# Altium schematic sheet ESP32S3.SchDoc
size A4; SheetNumber: 3; SheetTotal: 7
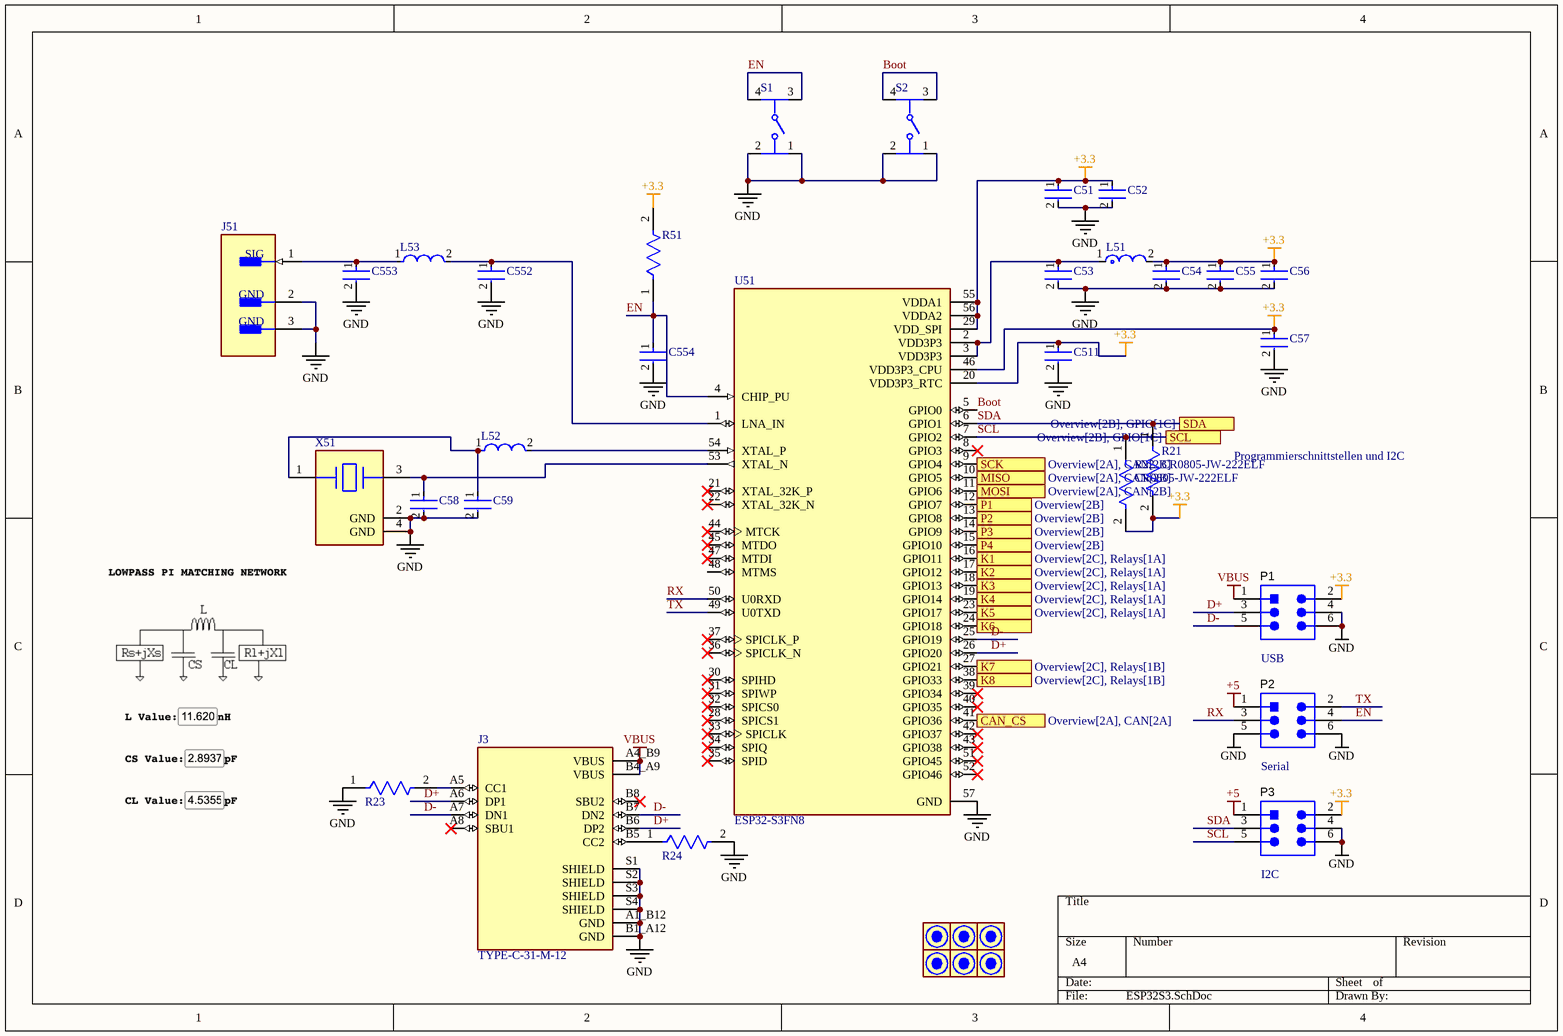
[diagram p0: ESP32S3.SchDoc]

## Parts
(Parts that share a designator on the sheet are numbered #1, #2 ... from top to bottom, then left to right.)
C51  GRM155R61A105KE15D  [FP-GRM15-0_1-MFG]  (value not drawn)
C52  C0603C103K8RACTU  [FP-C0603C-CF-MFG]  (value not drawn)
C53  CC0402KRX7R6BB104  [FP-CC0402-MFG]  (value not drawn)
C54  C0402C104K8PACTU  [FP-C0402-BB-MFG]  (value not drawn)
C55  GRM155R61A105KE15D  [FP-GRM15-0_1-MFG]  (value not drawn)
C56  CL05A106MP5NUNC  [FP-CL05A106MP5NUNC-MFG]  (value not drawn)
C57  C0402C104K8PACTU  [FP-C0402-BB-MFG]  (value not drawn)
C58  C0603C160J5GACTU  [FP-C0603C-CF-MFG]  (value not drawn)
C59  C0603C160J5GACTU  [FP-C0603C-CF-MFG]  (value not drawn)
C511  CC0402KRX7R6BB104  [FP-CC0402-MFG]  (value not drawn)
C552  GJM1555C1H2R8WB01D  [FP-GJM155-0_05-IPC_C]  (value not drawn)
C553  GJM1555C1H4R5BB01D  [FP-GJM155-0_05-IPC_C]  (value not drawn)
C554  C0402C123K4RACTU  [FP-C0402-BB-MFG]  (value not drawn)
J3  TYPE-C-31-M-12  [HRO_TYPE-C-31-M-12]
J51  U.FL-R-SMT-1(10)  [FP-U_FL-R-SMT-1_10-MFG]  (value not drawn)
L51  LQP03TN2N0B02D  [FP-LQP03TG_02-IPC_A]  (value not drawn)
L52  LQW15AN20NG00D  [FP-LQW15AN_00-W0_6-0_1-MFG]  (value not drawn)
L53  LQW15AN11NG00D  [FP-LQW15AN_00-W0_6-0_1-MFG]  (value not drawn)
M*#1  Passermarke  [Passermarke-Footprint-1]  (value not drawn)
M*#2  Passermarke  [Passermarke-Footprint-1]  (value not drawn)
M*#3  Passermarke  [Passermarke-Footprint-1]  (value not drawn)
M*#4  Passermarke  [Passermarke-Footprint-1]  (value not drawn)
M*#5  Passermarke  [Passermarke-Footprint-1]  (value not drawn)
M*#6  Passermarke  [Passermarke-Footprint-1]  (value not drawn)
P1  5-146130-2  [TECO-5-146130-2_V]  (value not drawn)
P2  5-146130-2  [TECO-5-146130-2_V]  (value not drawn)
P3  5-146130-2  [TECO-5-146130-2_V]  (value not drawn)
R21  CR0805-JW-222ELF  [FP-CR0805-IPC_B]
R22  CR0805-JW-222ELF  [FP-CR0805-IPC_B]
R23  CRCW06035K10FKEA  [FP-CRCW0603-e3-IPC_C]  (value not drawn)
R24  CRCW06035K10FKEA  [FP-CRCW0603-e3-IPC_C]  (value not drawn)
R51  CRCW04021K00FKED  [FP-CRCW0402-e3-MFG]  (value not drawn)
S1  (no value)  [FP-PTS645SM43SMTR92LFS-MFG]
S2  (no value)  [FP-PTS645SM43SMTR92LFS-MFG]
U51  ESP32-S3FN8  [QFN40P700X700X90-57N]
X51  X252040MMB4SI  [FP-ABM10-MFG]  (value not drawn)

## Ports
CAN_CS (see Overview[2A], CAN[2A]), K1 (see Overview[2C], Relays[1A]), K2 (see Overview[2C], Relays[1A]), K3 (see Overview[2C], Relays[1A]), K4 (see Overview[2C], Relays[1A]), K5 (see Overview[2C], Relays[1A]), K6 (see Overview[2C], Relays[1B]), K7 (see Overview[2C], Relays[1B]), K8 (see Overview[2C], Relays[1B]), MISO (see Overview[2A], CAN[2B]), MOSI (see Overview[2A], CAN[2B]), P1 (see Overview[2B]), P2 (see Overview[2B]), P3 (see Overview[2B]), P4 (see Overview[2B]), SCK (out, see Overview[2A], CAN[2B]), SCL (see Overview[2B], GPIO[1C]), SDA (see Overview[2B], GPIO[1C])

## Nets
+3.3: C51.1 C52.1 C54.1 C55.1 C56.1 C57.1 C511.1 L51.2 P1.2 P3.2 R21.2 R22.2 R51.2 U51.20(VDD3P3_RTC) U51.29(VDD_SPI) U51.46(VDD3P3_CPU) U51.55(VDDA1) U51.56(VDDA2)
+5: P2.1 P3.1
GND: C51.2 C52.2 C53.2 C54.2 C55.2 C56.2 C57.2 C58.2 C59.2 C511.2 C552.2 C553.2 C554.2 J3.A1_B12(GND) J3.B1_A12(GND) J3.S1(SHIELD) J3.S2(SHIELD) J3.S3(SHIELD) J3.S4(SHIELD) J51.2(GND) J51.3(GND) P1.4 P1.6 P2.5 P2.6 P3.4 P3.6 R23.1 R24.2 S1.1 S1.2 S2.1 S2.2 U51.57(GND) X51.2(GND) X51.4(GND)
VBUS: J3.A4_B9(VBUS) J3.B4_A9(VBUS) P1.1
Boot: S2.3 S2.4 U51.5(GPIO0)
CAN_CS: U51.41(GPIO36) ; port CAN_CS
D+: J3.A6(DP1) J3.B6(DP2) P1.3 U51.26(GPIO20)
D-: J3.A7(DN1) J3.B7(DN2) P1.5 U51.25(GPIO19)
EN: C554.1 P2.4 R51.1 S1.3 S1.4 U51.4(CHIP_PU)
K1: U51.16(GPIO11) ; port K1
K2: U51.17(GPIO12) ; port K2
K3: U51.18(GPIO13) ; port K3
K4: U51.19(GPIO14) ; port K4
K5: U51.23(GPIO17) ; port K5
K6: U51.24(GPIO18) ; port K6
K7: U51.27(GPIO21) ; port K7
K8: U51.38(GPIO33) ; port K8
MISO: U51.10(GPIO5) ; port MISO
MOSI: U51.11(GPIO6) ; port MOSI
P1: U51.12(GPIO7) ; port P1
P2: U51.13(GPIO8) ; port P2
P3: U51.14(GPIO9) ; port P3
P4: U51.15(GPIO10) ; port P4
RX: P2.3 U51.50(U0RXD)
SCK: U51.9(GPIO4) ; port SCK
SCL: P3.5 R22.1 U51.7(GPIO2) ; port SCL
SDA: P3.3 R21.1 U51.6(GPIO1) ; port SDA
TX: P2.2 U51.49(U0TXD)
NetC53_1: C53.1 L51.1 U51.2(VDD3P3) U51.3(VDD3P3)
NetC58_1: C58.1 U51.53(XTAL_N) X51.3
NetC59_1: C59.1 L52.1 X51.1
NetC552_1: C552.1 L53.2 U51.1(LNA_IN)
NetC553_1: C553.1 J51.1(SIG) L53.1
NetJ3_A5: J3.A5(CC1) R23.2
NetJ3_B5: J3.B5(CC2) R24.1
NetL52_2: L52.2 U51.54(XTAL_P)

Not connected (* = marked no-connect by the designer): J3 A8(SBU1)* B8(SBU2)*; U51 8(GPIO3)* 21(XTAL_32K_P)* 22(XTAL_32K_N)* 28(SPICS1)* 30(SPIHD)* 31(SPIWP)* 32(SPICS0)* 33(SPICLK)* 34(SPIQ)* 35(SPID)* 36(SPICLK_N)* 37(SPICLK_P)* 39(GPIO34)* 40(GPIO35)* 42(GPIO37)* 43(GPIO38)* 44(MTCK)* 45(MTDO)* 47(MTDI)* 48(MTMS) 51(GPIO45)* 52(GPIO46)*

## Notes on the sheet
- Programmierschnittstellen und I2C
- USB
- Serial
- (near P3) I2C

## Library data of the parts
C51 C55 = CMP-2008-04556-2: CAP CER 1UF 10V X5R 0402; Manufacturer: Murata; Material: Ceramic; Tolerance: 10%; Temperature Coefficient: 15%; Octopart: https://octopart.com/grm155r61a105ke15d-murata-197442; Manufacturer Part Number: GRM155R61A105KE15D; Lead Free: Yes; ComponentLink2Description: Datasheet; Temperature: -55°C to +85°C; Temperature Range High: +85°C; Height: 0.55mm; Capacitance: 1uF; Ipc Land Pattern Name: CAPC10050X50; ComponentLink2URL: https://search.murata.co.jp/Ceramy/image/img/A01X/G101/ENG/GRM155R61A105KE15-01A.pdf; Temperature Range Low: -55°C; Device Class L2: Capacitors; Voltage Rating: 10V; RoHS: TRUE; Device Class L1: Passive Components; Device Class L3: Ceramic Capacitors; Temperature Characteristic: X5R; Mouser Description: 0402 1 uF 10 V ±10% Tolerance X5R Surface Mount Multilayer Ceramic Capacitor; Automotive: No; Package: GRM15-0.1; Digikey Description: CAP CER 1UF 10V X5R 0402; Value: 1uF; Category: Cap
C52 = CMP-2006-03048-2: CAP CER 10000PF 10V X7R 0603; Manufacturer: KEMET; Material: Ceramic; Automotive Grade: Grade 1; Value: 10,000 pF; Tolerance: 0.1; Temperature Coefficient: 30ppm/°C; ComponentLink2Description: Datasheet; Automotive: Yes; Mouser Description: Multilayer Ceramic Capacitors MLCC - SMD/SMT 10volts 10000pF X7R 10%; Device Class L3: Ceramic Capacitors; Octopart: https://octopart.com/c0603c103k8ractu-kemet-8375724; Digikey Description: CAP CER 10000PF 10V X7R 0603; Temperature: -55°C to +125°C; Temperature Characteristic: X7R; Device Class L1: Passive Components; Capacitance: 10,000 pF; Lead Free: Yes; Voltage Rating: 10 V; Category: Cap; Height: 0.87mm; Package: C0603C-CF; RoHS: TRUE; Temperature Range High: +125°C; Device Class L2: Capacitors; ComponentLink2URL: https://api.kemet.com/component-edge/download/datasheet/C0603C100J5GACAUTO.pdf; Temperature Range Low: -55°C; Manufacturer Part Number: C0603C103K8RACTU
C53 C511 = CMP-03422-000748-1: CAP CER 0.1UF 10V X7R 0402; Manufacturer: YAGEO; Tolerance: 0.1; Value: 100 nF; Temperature Coefficient: 30ppm/°C; Material: Ceramic; Automotive Grade: NA; Ipc Land Pattern Name: CAPC10050X50; Temperature Range Low: -55°C; Temperature: -55°C to +125°C; Footprint Url: http://www.yageo.com/exep/pages/download/literatures/UPY-C_GEN_24.pdf; Device Class L2: Capacitors; ComponentLink2Description: Datasheet; Temperature Characteristic: X7R; Height: 0.55mm; Mouser Description: Multilayer Ceramic Capacitors MLCC - SMD/SMT 100nF 10V X7R 10%; Temperature Range High: +125°C; Package: CC0402; Digikey Description: CAP CER 0.1UF 10V X7R 0402; Automotive: No; Manufacturer Part Number: CC0402KRX7R6BB104; Voltage Rating: 10 V; Octopart: https://octopart.com/cc0402krx7r6bb104-yageo-8376509; Capacitance: 100 nF; ComponentLink2URL: http://www.yageo.com/documents/recent/UPY-GP_NP0_16V-to-50V_16.pdf; Category: Cap; Lead Free: Yes; Device Class L3: Ceramic Capacitors; RoHS: TRUE; Device Class L1: Passive Components
C54 C57 = CMP-2008-02046-2: CAP CER 0.1UF 10V X5R 0402; Manufacturer: Kemet; Material: Ceramic; Capacitance: 0.10 μF; Temperature Coefficient: 15%; Tolerance: 0.1; Value: 0.10 μF; Package: C0402-BB; Temperature: -55°C to +125°C; ComponentLink2Description: Datasheet; Temperature Characteristic: X5R; Device Class L1: Passive Components; Height: 0.55mm; Lead Free: Yes; ComponentLink2URL: https://content.kemet.com/datasheets/KEM_C1002_X7R_SMD.pdf; Device Class L2: Capacitors; Temperature Range Low: -55°C; Temperature Range High: +125°C; RoHS: TRUE; Octopart: https://octopart.com/c0402c104k8pactu-kemet-140039; Automotive: No; Mouser Description: Capacitor 100 nF 10 VDC 0402; Category: Cap; Voltage Rating: 10 V; Digikey Description: CAP CER 0.1UF 10V X5R 0402; Ipc Land Pattern Name: CAPC10050X50; Device Class L3: Ceramic Capacitors; Manufacturer Part Number: C0402C104K8PACTU
C56 = CMP-13271-000002-1: CAP CER 10UF 10V X5R 0402; Manufacturer: Samsung; Temperature Coefficient: 15%; Tolerance: 20%; Material: Ceramic; Octopart: https://octopart.com/cl05a106mp5nunc-samsung-22457395; Voltage Rating: 10V; RoHS: TRUE; Value: 10uF; Height: 0.7mm; Digikey Description: CAP CER 10UF 10V X5R 0402; Automotive: No; Package: CL05A106MP5NUNC; Device Class L1: Passive Components; Capacitance: 10uF; Temperature Range High: +85°C; ComponentLink2Description: Datasheet; Device Class L2: Capacitors; Temperature Characteristic: X5R; Manufacturer Part Number: CL05A106MP5NUNC; Temperature: -55°C to +85°C; ComponentLink2URL: http://www.samsungsem.com/kr/support/product-search/mlcc/__icsFiles/afieldfile/2019/05/10/19-CL05A106MP5NUNC.pdf; Device Class L3: Ceramic Capacitors; Category: Cap; Temperature Range Low: -55°C; Ipc Land Pattern Name: CAPC10050X50; Lead Free: Yes
C58 C59 = CMP-1035-00716-3: CAP CER 16PF 50V 5% NP0 0603; Manufacturer: KEMET; Automotive Grade: Grade 1; Material: Ceramic; Temperature Coefficient: 30ppm/°C; Tolerance: 0.05; Temperature Characteristic: C0G; Manufacturer Part Number: C0603C160J5GACTU; Octopart: https://octopart.com/c0603c160j5gactu-kemet-9143816; ComponentLink2URL: https://api.kemet.com/component-edge/download/datasheet/C0603C100J5GACAUTO.pdf; Category: Cap; Mouser Description: Multilayer Ceramic Capacitors MLCC - SMD/SMT 50volts 16pF C0G 5%; Device Class L1: Passive Components; Capacitance: 16 pF; Voltage Rating: 50 V; Temperature Range Low: -55°C; Automotive: Yes; Device Class L3: Ceramic Capacitors; Package: C0603C-CF; Temperature Range High: +125°C; Digikey Description: CAP CER 16PF 50V 5% NP0 0603; Value: 16 pF; Lead Free: Yes; Height: 0.87mm; Device Class L2: Capacitors; Temperature: -55°C to +125°C; ComponentLink2Description: Datasheet; RoHS: TRUE
C552 = CMP-2008-03767-2: Multi-Layer Ceramic Capacitor 2.8pF C0G  ±0.05pF 0402 Paper T/R; Voltage Rating (DC): 50V; Case Code (Metric): 1005; Max Operating Temperature: 125°C; Case Code (Imperial): 0402; Width: 0.02inch; Package Quantity: 10000; Case/Package: 0402; Depth: 0.5mm; Radiation Hardening: No; Mount: Surface Mount; Min Operating Temperature: -55°C; Termination: SMD/SMT; Capacitance: 2.8pF; Dielectric: C0G; Thickness: 0.022inch; Length: 1mm; Voltage Rating: 50V; Height: 0.5mm; Packaging: Tape and Reel
C553 = CMP-2008-03776-2: Multi-Layer Ceramic Capacitor 4.5pF C0G  ±0.1pF 0402 Paper T/R; Voltage Rating (DC): 50V; Case Code (Metric): 1005; Length: 1mm; Dielectric: C0G; Package Quantity: 1; Radiation Hardening: No; Case/Package: 0402; Termination: SMD/SMT; Min Operating Temperature: -55°C; Packaging: Tape and Reel; Voltage Rating: 50V; Capacitance: 4.5pF; Case Code (Imperial): 0402; Thickness: 0.022inch; Depth: 0.5mm; Max Operating Temperature: 125°C; Height: 0.5mm; Mount: Surface Mount; Width: 0.02inch
C554 = CMP-1034-01896-3: CAP CER 0.012UF 16V X7R 0402; Manufacturer: Kemet; Tolerance: 0.1; Capacitance: 12,000 pF; Temperature Coefficient: 15%; Value: 12,000 pF; Material: Ceramic; Automotive: No; Temperature Characteristic: X7R; Device Class L1: Passive Components; Height: 0.55mm; Manufacturer Part Number: C0402C123K4RACTU; Device Class L2: Capacitors; Package: C0402-BB; Temperature Range Low: -55°C; Ipc Land Pattern Name: CAPC10050X50; Temperature: -55°C to +125°C; Octopart: https://octopart.com/c0402c123k4ractu-kemet-136706; Lead Free: Yes; Temperature Range High: +125°C; Voltage Rating: 16 V; RoHS: TRUE; Mouser Description: Multilayer Ceramic Capacitors MLCC - SMD/SMT 16volts 12000pF X7R 10%; Category: Cap; ComponentLink2Description: Datasheet; ComponentLink2URL: https://content.kemet.com/datasheets/KEM_C1002_X7R_SMD.pdf; Device Class L3: Ceramic Capacitors; Digikey Description: CAP CER 0.012UF 16V X7R 0402
J3 = CMP-023-000000-1: USB Connectors 24 Receptacle 1 8.94*7.3mm RoHS; MF: HRO Electronics Co., Ltd.; Source: TYPE-C-31-M-12.SchLib; Pin Count: 16; Availability: Not in stock; Package: Package; Price: None; Check_prices: https://www.snapeda.com/parts/TYPE-C-31-M-12/HRO+Electronics+Co.%252C+Ltd./view-part/?ref=eda; MP: TYPE-C-31-M-12; Component Type: Standard; Value: *; SnapEDA_Link: https://www.snapeda.com/parts/TYPE-C-31-M-12/HRO+Electronics+Co.%252C+Ltd./view-part/?ref=snap; Design Item ID: TYPE-C-31-M-12
J51 = CMP-2000-05152-3: CONN U.FL RCPT STR 50 OHM SMD; Max Frequency: 6GHz; Connector Type: Coaxial; Body Plating: Silver; Body Material: Bronze; Impedance: 50R; Dielectric Material: Polymer; Insulation Resistance: 500MR; Gender: Male; Packaging: Cut Tape; Length: 3mm; Package Quantity: 2500; Termination: Solder; Lead Free: Lead Free; Series: U.FL; Min Operating Temperature: -40°C; Fastening Type: Snap; Contact Material: Brass; Orientation: Straight; Wire/Cable Type: Coaxial; Frequency: 6GHz; Contact Plating: Gold; Depth: 3.1mm; Weight: 0.001764oz; Max Operating Temperature: 90°C; Radiation Hardening: No; REACH SVHC: No SVHC; Mount: Surface Mount; Housing Color: Beige
L51 = CMP-06042-013297-1: Film type RF Inductor 2nH ±0.1nH 600mA 0.15Ω 0201 (0603); Current: 400mA; DC Resistance (DCR): 150mR; Core Material: Non-Magnetic; Q Factor: 14; Shielding: Unshielded; Self Resonant Frequency: 12.5GHz; Test Frequency: 500MHz; Height - Seated (Max): 0.013inch; Case/Package: 0201; Depth: 0.33mm; Width: 0.012inch; Mount: Surface Mount; Case Code (Imperial): 0201; Packaging: Tape and Reel; Max DC Current: 600mA; Resistor Type: Thin Film; Case Code (Metric): 0603; Length: 0.6mm; Termination: SMD/SMT; Max Operating Temperature: 125°C; Inductance: 2nH; REACH SVHC: No SVHC; DC Current: 600mA; Package Quantity: 15000; Height: 0.3mm; Military Standard: Not; Min Operating Temperature: -55°C; Current Rating: 600mA
L52 = CMP-06042-008146-1: Wire Wound RF Inductor 20nH ±2% 370mA 0.27Ω 0402 (1005); Q Factor: 25; Current: 850mA; DC Resistance (DCR): 270mR; Core Material: Air; Shielding: Unshielded; Test Frequency: 100MHz; Self Resonant Frequency: 4GHz; Mount: Surface Mount; Lead Free: Lead Free; Package Quantity: 10000; Case Code (Metric): 1005; Case/Package: 0402; DC Current: 370mA; Max DC Current: 370mA; Weight: 2.8E-05oz; Width: 0.02inch; Termination: SMD/SMT; Packaging: Tape and Reel; REACH SVHC: No SVHC; Height: 0.5mm; Case Code (Imperial): 0402; Depth: 0.7mm; Military Standard: Not; Radiation Hardening: No; Inductance Tolerance: 2%; Length: 1mm; Max Operating Temperature: 125°C; Min Operating Temperature: -55°C; Inductance: 20nH; Current Rating: 370mA; Tolerance: 2%
L53 = CMP-06042-008305-1: Wire Wound RF Inductor 11nH ±2% 500mA 0.14Ω 0402 (1005); Core Material: Non-Magnetic; Q Factor: 30; DC Resistance (DCR): 140mR; Shielding: Unshielded; Current: 370mA; Self Resonant Frequency: 5.5GHz; Test Frequency: 100MHz; Max DC Current: 500mA; Weight: 2.8E-05oz; Radiation Hardening: No; Mount: Surface Mount; Width: 0.02inch; Current Rating: 500mA; DC Current: 500mA; Packaging: Tape and Reel; Height: 0.5mm; Length: 1mm; Resistor Type: Wirewound; Inductance: 11nH; Height - Seated (Max): 0.024inch; Case Code (Metric): 1005; Max Operating Temperature: 125°C; Case/Package: 0402; Package Quantity: 10000; Tolerance: 2%; Termination: SMD/SMT; Military Standard: Not; Depth: 0.7mm; Min Operating Temperature: -55°C; Lead Free: Lead Free; Case Code (Imperial): 0402
M*#1-M*#6 = CMP-00001-2
P1-P3 = CMP-1684-00011-1: Male Header, Pitch 2.54 mm, 2 x 3 Position, Height 8.13 mm, -65 to 125 degC, RoHS, Tube; Max Supply Voltage: 5.5 V; Min Supply Voltage: 4.5 V; Nominal Supply Voltage: 5 V; Min Operating Temperature: -40 degC; ComponentLink1URL: http://www.te.com/; ComponentLink2Description: Datasheet; Pins: 3; Max Operating Temperature: 150 degC; PackageDescription: Male Header, Pitch 2.54 mm, 2 x 3 Position, Height 8.13 mm; Package Quantity: 3000; PackageReference: 5-146130-2; DatasheetVersion: Oct-15; ComponentLink1Description: Manufacturer URL; Radiation Hardening: No; Mount: Surface Mount; RoHSCompliant: true; Packaging: Tape and Reel; ComponentLink2URL: http://www.te.com/commerce/DocumentDelivery/DDEController?Action=showdoc&DocId=Customer+Drawing%7F146130%7FM%7Fpdf%7FEnglish%7FENG_CD_146130_M.pdf%7F5-146130-2
R21 R22 = CMP-07231-003724-1: Thick Film Chip Resistors 0805 2.2kΩ 0.125W 5% 200ppm/°C; Voltage Rating: 150V; Max Power Dissipation: 125mW; Resistance: 2.2kR; Packaging: Tape and Reel; REACH SVHC: No SVHC; Case Code (Metric): 2012; Thickness: 508um; Depth: 1.25mm; Radiation Hardening: No; Features: Moisture Resistant; Number of Terminations: 2; Max Operating Temperature: 155°C; Length: 2mm; Width: 1.25mm; Termination: SMD/SMT; Case/Package: 0805; Composition: Thick Film; Package Quantity: 1; Height: 0.024inch; Min Operating Temperature: -55°C; Voltage Rating (DC): 150V; Power Rating: 125mW; Mount: Surface Mount; Contact Plating: Tin; Tolerance: 5%; Military Standard: Not; Case Code (Imperial): 0805; Temperature Coefficient: 200ppm/°C
R23 R24 = CMP-1012-00590-3: RES Thick Film, 5.1kΩ, 1%, 0.1W, 100ppm/°C, 0603; Power Rating: 100mW; Voltage Rating (DC): 75V; Resistance: 5.1kR; Width: 0.85mm; Depth: 0.85mm; Military Standard: Not; Package Quantity: 5000; Case Code (Metric): 1608; Length: 1.55mm; Weight: 7.1E-05oz; Packaging: Tape and Reel; Temperature Coefficient: 100ppm/°C; Case Code (Imperial): 0603; Lead Free: Lead Free; Radiation Hardening: No; Contact Plating: Tin; Composition: Thick Film; Max Operating Temperature: 155°C; Termination: SMD/SMT; Case/Package: 0603; Min Operating Temperature: -55°C; Tolerance: 1%; Voltage Rating: 75V; Mount: Surface Mount; Height: 0.45mm
R51 = CMP-2002-08276-2: RES Thick Film, 1kΩ, 1%, 0.063W, 100ppm/°C, 0402; Resistance: 1kR; Power Rating: 63mW; Voltage Rating (DC): 50V; Package Quantity: 10; Termination: SMD/SMT; Width: 0.5mm; Military Standard: Not; Length: 1mm; Contact Plating: Tin; Mount: Surface Mount; Packaging: Tape and Reel; Case Code (Imperial): 0402; Tolerance: 1%; Weight: 2.3E-05oz; Number of Pins: 2; Case/Package: 0402; Case Code (Metric): 1005; Lead Free: Lead Free; Number of Terminations: 2; Max Power Dissipation: 63mW; Depth: 0.5mm; Temperature Coefficient: 100ppm/°C; Max Operating Temperature: 155°C; Height: 0.35mm; Features: Automotive AEC-Q200; Composition: Thick Film; Radiation Hardening: No; Voltage Rating: 50V; Min Operating Temperature: -55°C
S1 S2 = CMP-2000-05160-2: SWITCH TACTILE SPST-NO 0.05A 12V / PTS645SM43SMTR92LFS; Contact Resistance: 100mR; Throw Configuration: SPST; Illumination Type: Non-Illuminated; Mechanical Life: 100000Cycles; Current Rating: 50mA; Switch Function: Off-Mom; Actuator Length: 0.85mm; Actuator Material: Nylon; Actuator Type: Standard; Operating Force: 160gf; Min Operating Temperature: -20°C; REACH SVHC: No SVHC; Termination: Gull Wing; Case/Package: SMD/SMT; Packaging: Tape and Reel; Mount: Surface Mount; Voltage Rating (DC): 12V; Orientation: Straight; Lead Free: Lead Free; Contact Material: Silver; Color: Black; Max Current Rating: 50mA; Contact Plating: Silver; Depth: 9mm; Package Quantity: 1; Max Voltage Rating (DC): 12V; Length: 6mm; Max Operating Temperature: 60°C
U51 = ESP32-S3FN8: Espressif Systems [ENGINEERING SAMPLES]SMD IC , Dual-Core MCU, Wi-Fi 2.4G & BLE 5.0 combo, 8 MB Octal SPI PSRAM, QFN 56-pin, 7*7 mm; Check_prices: https://www.snapeda.com/parts/ESP32-S3FN8/Espressif+Systems/view-part/?ref=eda; MF: Espressif Systems; SnapEDA_Link: https://www.snapeda.com/parts/ESP32-S3FN8/Espressif+Systems/view-part/?ref=snap; Availability: In Stock; Price: None; Value: *; MP: ESP32-S3FN8; Package: None; Purchase-URL: https://pricing.snapeda.com/search/part/ESP32-S3FN8/?ref=eda
X51 = CMP-27762-005729-1: Crystal 40MHz ±20ppm 10pF SMD-4 2.5mm x 2mm; Frequency Stability: 30ppm; Series Resistance: 70R; Min Operating Temperature: -40°C; Height: 0.028inch; Frequency: 40MHz; Series: ABM10; Mount: Surface Mount; Termination: SMD/SMT; Package Quantity: 3000; Case/Package: SMD/SMT; Packaging: Tape and Reel; Tolerance: 20ppm; Length: 0.098inch; Number of Pins: 4; Load Capacitance: 10pF; RoHS Compliant: Yes; REACH SVHC: No SVHC; Width: 0.079inch; ESR (Equivalent Series Resistance): 70R; Frequency Tolerance: 20ppm; Max Operating Temperature: 85°C